# EAGLE schematic GND_STN (EAGLE 9.6.2)
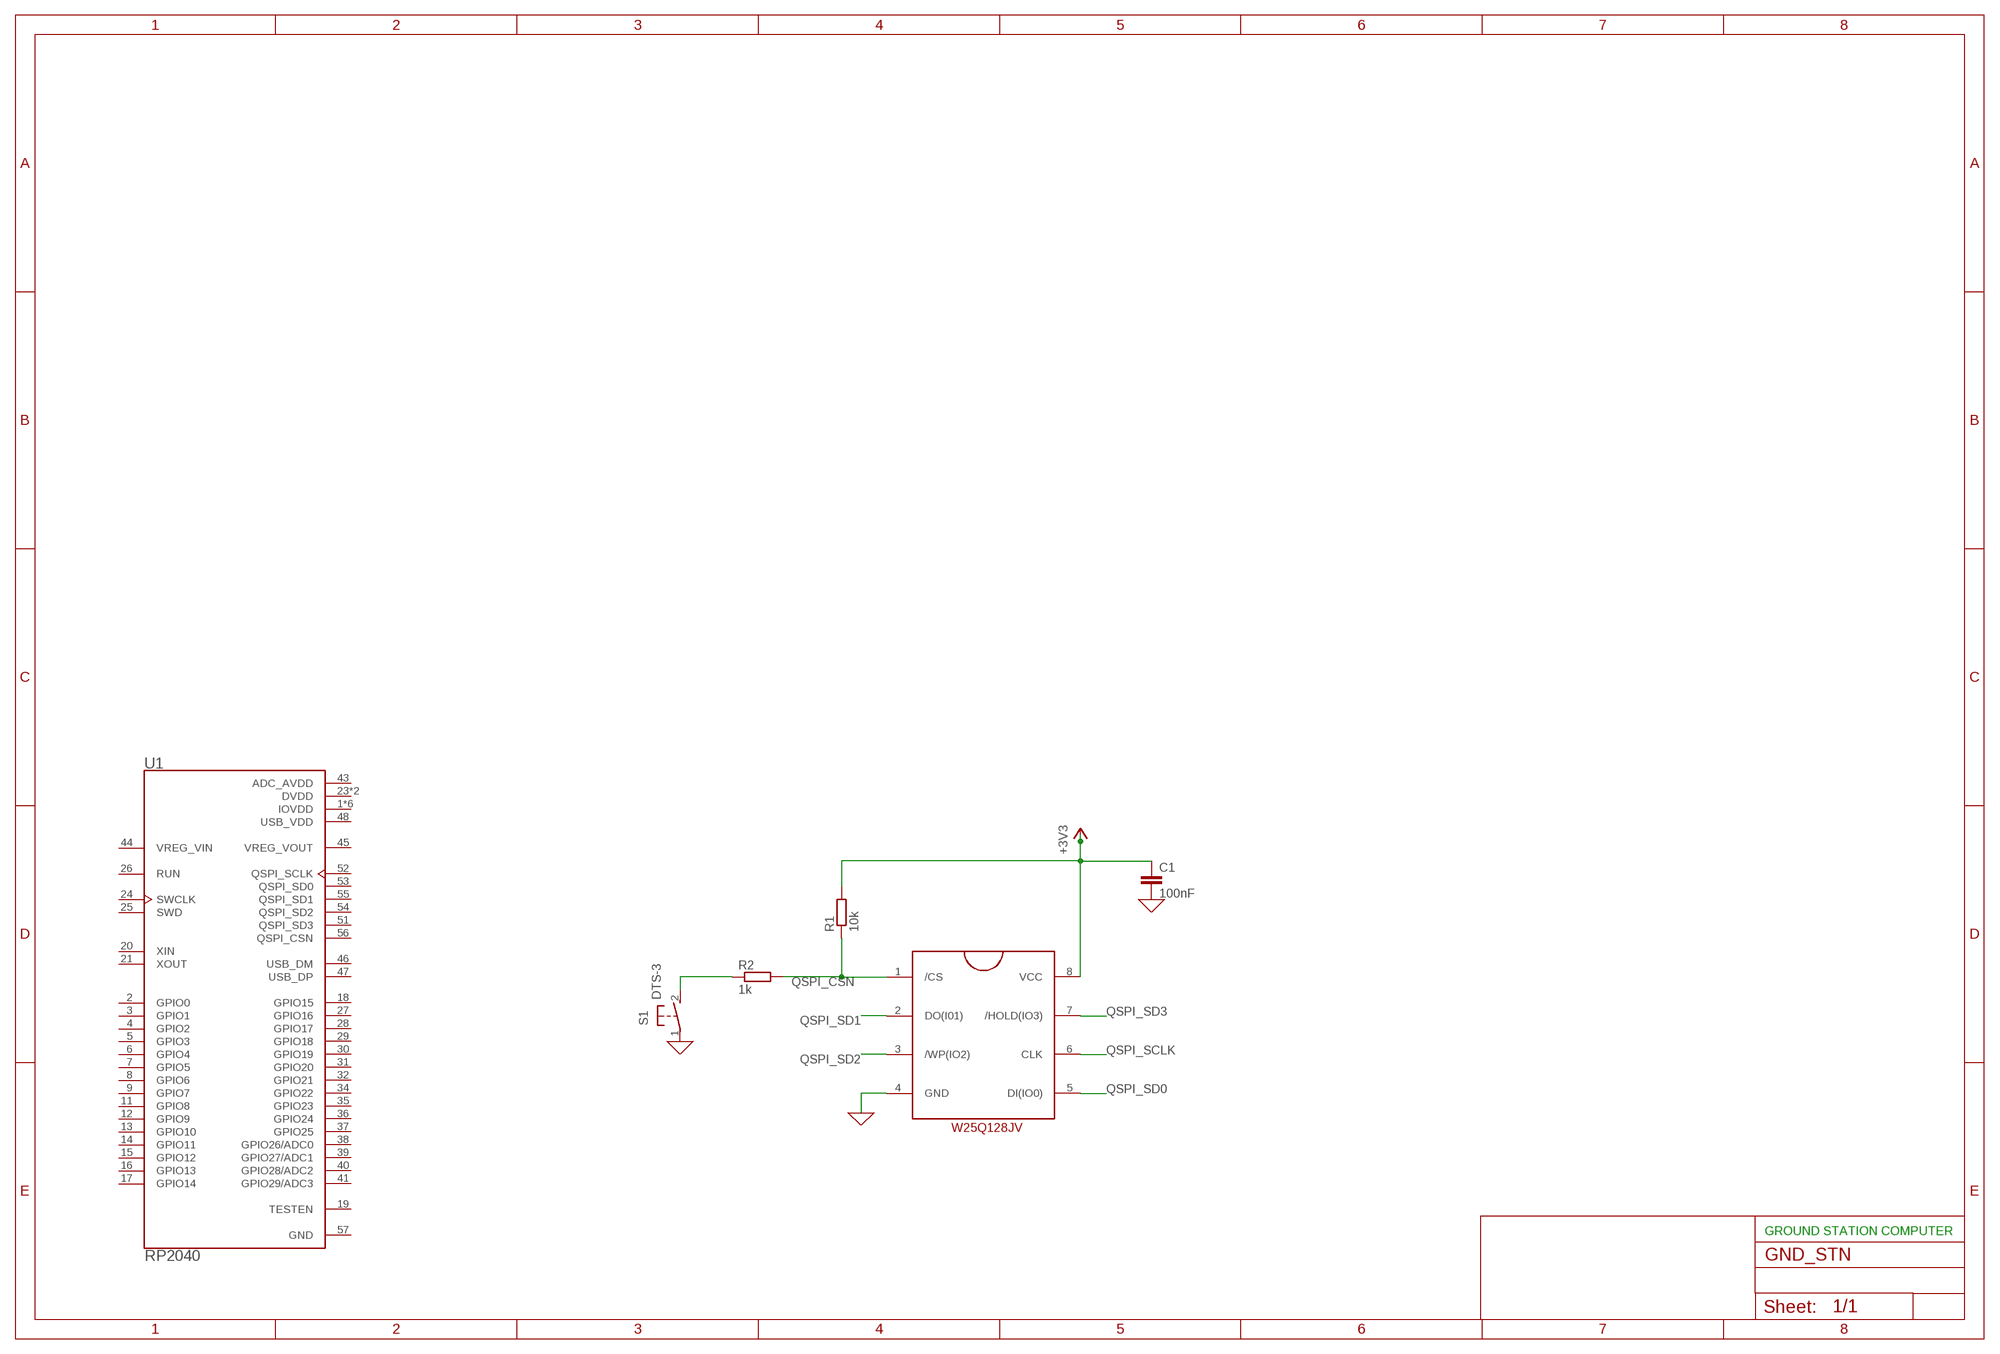
[diagram p0: schematic, sheet 1]

## Parts
C1  100nF  C-EUC0603  [C0603]
R1  10k  R-EU_R0603  [R0603]
R2  1k  R-EU_R0603  [R0603]
S1  DTS-3  [DTS-3]
U1  RP2040  [QFN40P700X700X90-57N]
U2  SOIC127P790X216-8NW25Q128JVJSQ  [SOIC127P790X216-8N]

## Nets
0: C1.2 S1.1 U2.4(GND) ; supply symbol labelled GND
+3V3: C1.1 R1.2 U2.8(VCC)
N$2: R2.1 S1.2
QSPI_CSN: R1.1 R2.2 U2.1(/CS)
QSPI_SCLK: U2.6(CLK)
QSPI_SD0: U2.5(DI(IO0))
QSPI_SD1: U2.2(DO(I01))
QSPI_SD2: U2.3(/WP(IO2))
QSPI_SD3: U2.7(/HOLD(IO3))
Unconnected: U1.2(GPIO0) U1.3(GPIO1) U1.4(GPIO2) U1.5(GPIO3) U1.6(GPIO4) U1.7(GPIO5) U1.8(GPIO6) U1.9(GPIO7) U1.11(GPIO8) U1.12(GPIO9) U1.13(GPIO10) U1.14(GPIO11) U1.15(GPIO12) U1.16(GPIO13) U1.17(GPIO14) U1.18(GPIO15) U1.19(TESTEN) U1.20(XIN) U1.21(XOUT) U1.24(SWCLK) U1.25(SWD) U1.26(RUN) U1.27(GPIO16) U1.28(GPIO17) U1.29(GPIO18) U1.30(GPIO19) U1.31(GPIO20) U1.32(GPIO21) U1.34(GPIO22) U1.35(GPIO23) U1.36(GPIO24) U1.37(GPIO25) U1.38(GPIO26/ADC0) U1.39(GPIO27/ADC1) U1.40(GPIO28/ADC2) U1.41(GPIO29/ADC3) U1.44(VREG_VIN) U1.45(VREG_VOUT) U1.46(USB_DM) U1.47(USB_DP) U1.51(QSPI_SD3) U1.52(QSPI_SCLK) U1.53(QSPI_SD0) U1.54(QSPI_SD2) U1.55(QSPI_SD1) U1.56(QSPI_CSN)

## Notes on the sheet
- GROUND STATION COMPUTER

## Power pins joined to a net without a drawn wire
ADC_AVDD: U1.43(ADC_AVDD)
DVDD: U1.23(DVDD) U1.50(DVDD)
GND: U1.57(GND)
IOVDD: U1.1(IOVDD) U1.10(IOVDD) U1.22(IOVDD) U1.33(IOVDD) U1.42(IOVDD) U1.49(IOVDD)
USB_VDD: U1.48(USB_VDD)

## Library data of the parts
C1 = rcl:C-EU: CAPACITOR, European symbol; SPICEPREFIX: C
R1 R2 = rcl:R-EU_: RESISTOR, European symbol; SPICEPREFIX: R
S1 = DTS-3:DTS-3: Check availability <https://pricing.snapeda.com/parts/DTS-3/APEM%20Inc./view-part?ref=eda>; AVAILABILITY: Not in stock; CHECK_PRICES: https://www.snapeda.com/parts/DTS-3/APEM/view-part/?ref=eda; DESCRIPTION: Tactile Switch SPST-NO Top Actuated Through Hole; MF: APEM Inc.; MP: DTS-3; PACKAGE: DIP-10 APEM Inc.; PRICE: None; SNAPEDA_LINK: https://www.snapeda.com/parts/DTS-3/APEM/view-part/?ref=snap
U1 = RP2040:RP2040: Check availability <https://pricing.snapeda.com/parts/RP2040/Raspberry%20Pi/view-part?ref=eda>; AVAILABILITY: Not in stock; CHECK_PRICES: https://www.snapeda.com/parts/RP2040/Raspberry+Pi/view-part/?ref=eda; DESCRIPTION: RP2040 chip for Raspberry Pi Pico - ARM® Cortex®-M0+ MCU 32-Bit; MF: Raspberry Pi; MP: RP2040; PACKAGE: None; PRICE: None; SNAPEDA_LINK: https://www.snapeda.com/parts/RP2040/Raspberry+Pi/view-part/?ref=snap
U2 = SOIC127P790X216-8N:SOIC127P790X216-8N